# Altium schematic sheet [0] TOP.SchDoc
size A4
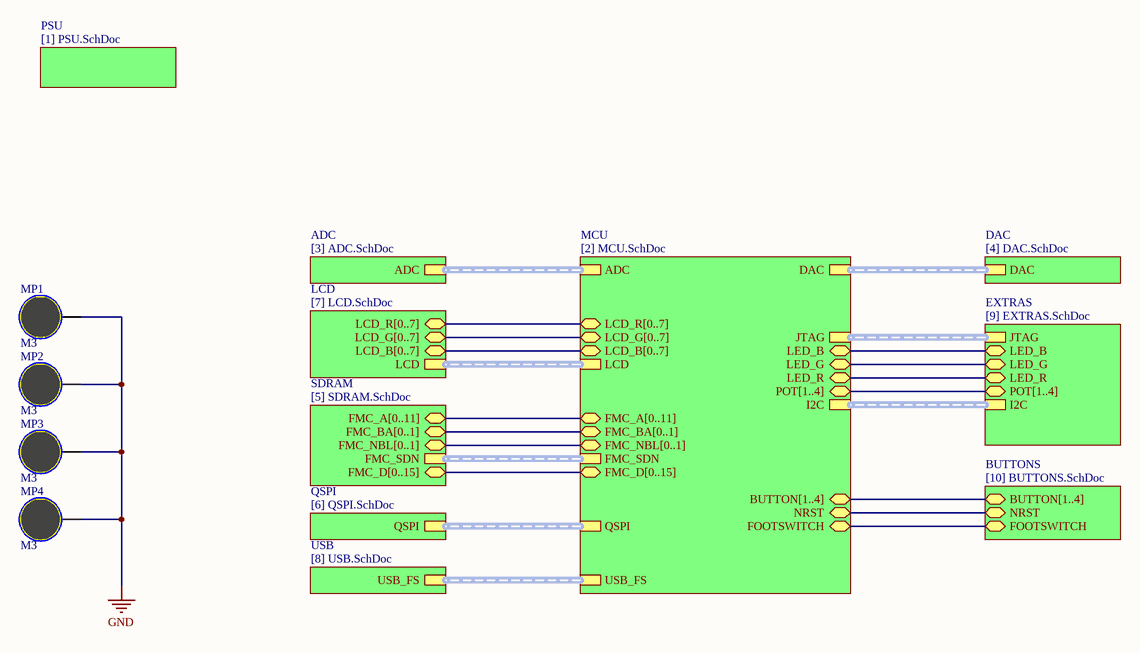
[diagram p0: [0] TOP.SchDoc]

## Parts
MP1  M3  [Mechanical screw M3]
MP2  M3  [Mechanical screw M3]
MP3  M3  [Mechanical screw M3]
MP4  M3  [Mechanical screw M3]

## Sub-sheets
ADC = [3] ADC.SchDoc: ADC (harness ADC)
BUTTONS = [10] BUTTONS.SchDoc: BUTTON[1..4] (bidir), NRST (bidir), FOOTSWITCH (bidir)
DAC = [4] DAC.SchDoc: DAC (harness DAC)
EXTRAS = [9] EXTRAS.SchDoc: JTAG (harness JTAG), LED_B (bidir), LED_G (bidir), LED_R (bidir), POT[1..4] (bidir), I2C (harness I2C)
LCD = [7] LCD.SchDoc: LCD_R[0..7] (bidir), LCD_G[0..7] (bidir), LCD_B[0..7] (bidir), LCD (harness LCD)
MCU = [2] MCU.SchDoc: BUTTON[1..4] (bidir), NRST (bidir), FOOTSWITCH (bidir), JTAG (harness JTAG), I2C (harness I2C), POT[1..4] (bidir), LED_B (bidir), LED_G (bidir), LED_R (bidir), USB_FS (harness USB), LCD (harness LCD), LCD_R[0..7] (bidir), LCD_G[0..7] (bidir), LCD_B[0..7] (bidir), QSPI (harness QSPI), FMC_NBL[0..1] (bidir), FMC_SDN (harness FMC_SDN), FMC_D[0..15] (bidir), FMC_BA[0..1] (bidir), FMC_A[0..11] (bidir), DAC (harness DAC), ADC (harness ADC)
PSU = [1] PSU.SchDoc: no entries
QSPI = [6] QSPI.SchDoc: QSPI (harness QSPI)
SDRAM = [5] SDRAM.SchDoc: FMC_A[0..11] (bidir), FMC_BA[0..1] (bidir), FMC_NBL[0..1] (bidir), FMC_SDN (harness FMC_SDN), FMC_D[0..15] (bidir)
USB = [8] USB.SchDoc: USB_FS (harness USB)

## Nets
GND: MP1.0 MP2.0 MP3.0 MP4.0
(unnamed): sheet MCU/NRST, sheet BUTTONS/NRST
(unnamed): sheet MCU/FOOTSWITCH, sheet BUTTONS/FOOTSWITCH
(unnamed): sheet MCU/LED_B, sheet EXTRAS/LED_B
(unnamed): sheet MCU/LED_G, sheet EXTRAS/LED_G
(unnamed): sheet MCU/LED_R, sheet EXTRAS/LED_R

## Buses and harness runs
bus sheet BUTTONS/BUTTON[1..4] = sheet MCU/BUTTON[1..4]
bus sheet EXTRAS/POT[1..4] = sheet MCU/POT[1..4]
bus sheet LCD/LCD_B[0..7] = sheet MCU/LCD_B[0..7]
bus sheet LCD/LCD_G[0..7] = sheet MCU/LCD_G[0..7]
bus sheet LCD/LCD_R[0..7] = sheet MCU/LCD_R[0..7]
bus sheet MCU/FMC_A[0..11] = sheet SDRAM/FMC_A[0..11]
bus sheet MCU/FMC_BA[0..1] = sheet SDRAM/FMC_BA[0..1]
bus sheet MCU/FMC_D[0..15] = sheet SDRAM/FMC_D[0..15]
bus sheet MCU/FMC_NBL[0..1] = sheet SDRAM/FMC_NBL[0..1]
harness sheet ADC/ADC = sheet MCU/ADC
harness sheet DAC/DAC = sheet MCU/DAC
harness sheet EXTRAS/I2C = sheet MCU/I2C
harness sheet EXTRAS/JTAG = sheet MCU/JTAG
harness sheet LCD/LCD = sheet MCU/LCD
harness sheet MCU/FMC_SDN = sheet SDRAM/FMC_SDN
harness sheet MCU/QSPI = sheet QSPI/QSPI
harness sheet MCU/USB_FS = sheet USB/USB_FS

## Library data of the parts
MP1-MP4 = Mechanical screw M3